# Altium schematic sheet STM32WL_Sensors.SchDoc
size A4; SheetNumber: 4; SheetTotal: 5
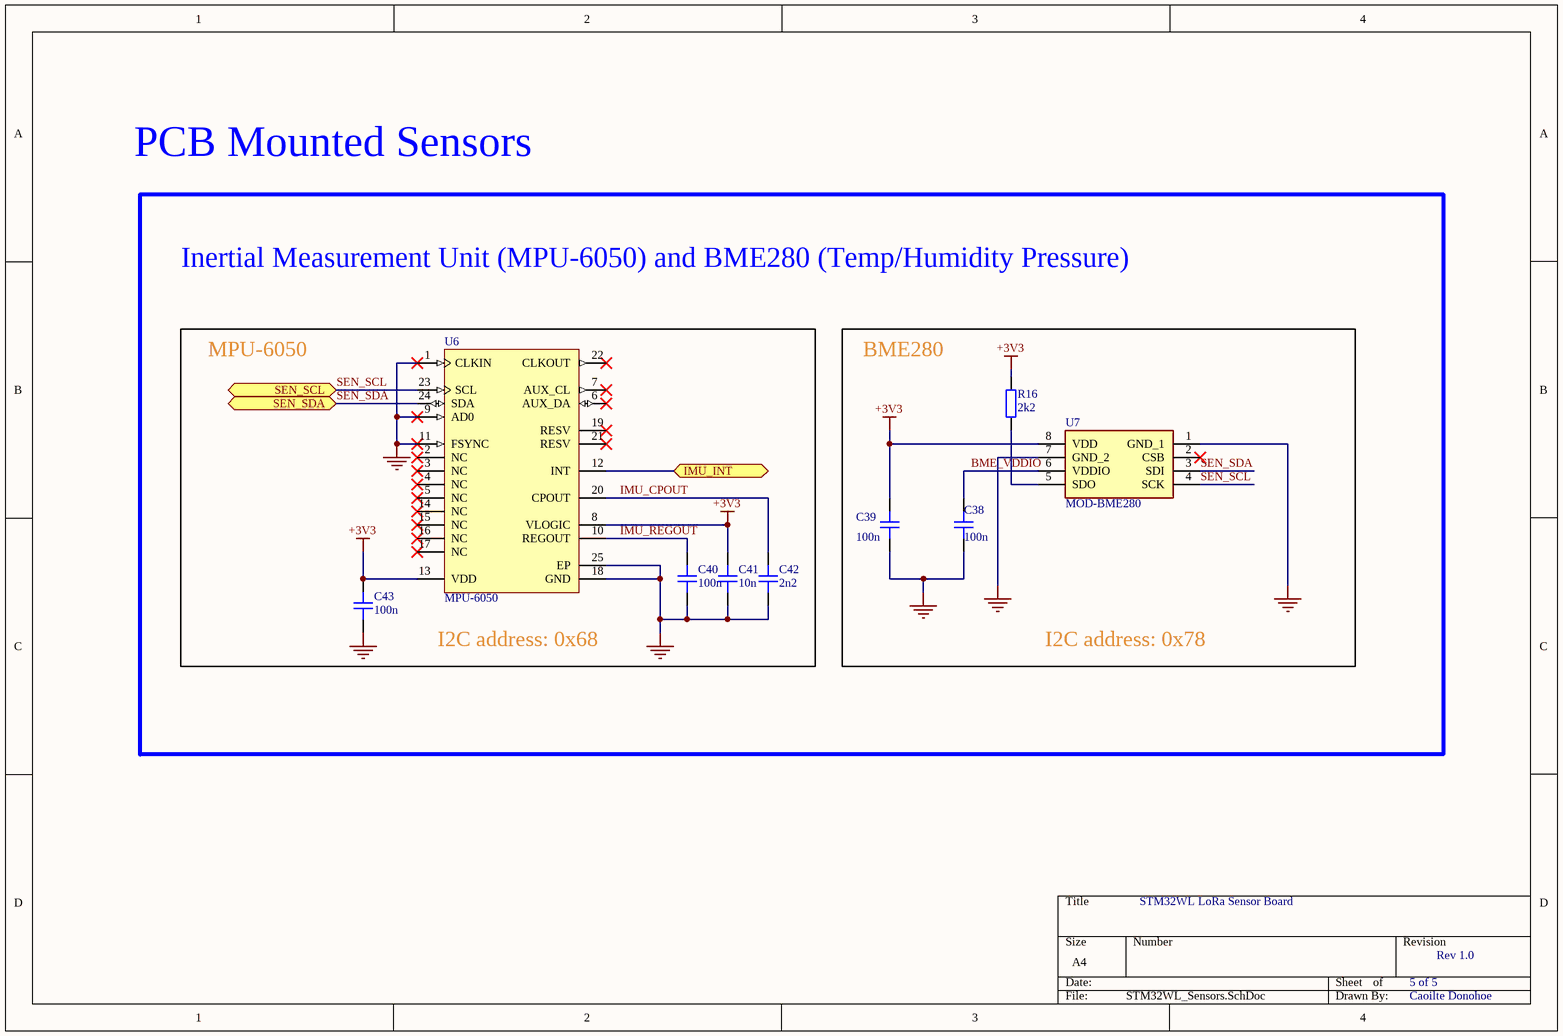
[diagram p0: STM32WL_Sensors.SchDoc]

## Parts
C38  100n  [CAP_0402]
C39  100n  [CAP_0402]
C40  100n  [CAP_0402]
C41  10n  [CAP_0402]
C42  2n2  [CAP_0402]
C43  100n  [CAP_0402]
R16  2k2  [RES_0402]
U6  MPU-6050  [IS-QFN-24_V]
U7  MOD-BME280  [MODBME280]

## Ports
IMU_INT (bidir, see STM32WL_MCU_IOs[1B]), SEN_SCL (bidir, see STM32WL_MCU_IOs[3B]), SEN_SDA (bidir, see STM32WL_MCU_IOs[3B])

## Nets
+3V3: C39.2 C41.2 C43.2 R16.2 U6.8(VLOGIC) U6.13(VDD) U7.8(VDD)
GND: C38.1 C39.1 C40.1 C41.1 C42.1 C43.1 U6.1(CLKIN) U6.9(AD0) U6.11(FSYNC) U6.18(GND) U6.25(EP) U7.1(GND_1) U7.7(GND_2)
BME_VDDIO: C38.2 U7.6(VDDIO)
IMU_CPOUT: C42.2 U6.20(CPOUT)
IMU_INT: U6.12(INT) ; port IMU_INT
IMU_REGOUT: C40.2 U6.10(REGOUT)
SEN_SCL: U6.23(SCL) U7.4(SCK) ; port SEN_SCL
SEN_SDA: U6.24(SDA) U7.3(SDI) ; port SEN_SDA
NetR16_1: R16.1 U7.5(SDO)

Not connected (* = marked no-connect by the designer): U6 2(NC)* 3(NC)* 4(NC)* 5(NC)* 6(AUX_DA)* 7(AUX_CL)* 14(NC)* 15(NC)* 16(NC)* 17(NC)* 19(RESV)* 21(RESV)* 22(CLKOUT)*; U7 2(CSB)*

## Notes on the sheet
- PCB Mounted Sensors
- Inertial Measurement Unit (MPU-6050) and BME280 (Temp/Humidity Pressure)
- MPU-6050
- BME280
- I2C address: 0x68
- I2C address: 0x78
- STM32WL LoRa Sensor Board
- 5 of 5
- Rev 1.0
- Caoilte Donohoe
- Labels drawn without touching a wire or pin: BME_SDO

## Library data of the parts
C38-C43 = CAP_0402_16V: Capacitor SMD 0402 16V
R16 = RES_0402: Resistor SMD 0402
U6 = CMP-1753-00002-2: 3-Axis Gyroscope, Accelerometer and a Digital Motion Processor(TM) (DMP), 2.375 to 3.46 V, -40 to 85 degC, 24-Pin QFN, RoHS, Tape and Reel; Manufacturer: InvenSense; Featured Product: MPU-60506-Axis,IntegratedI²CSolution; Other Names: 1428-1007-2 / MPU6050; Sensor Type: MotionTracking; Online Catalog: MPU-6000™Series; Unit PriceUSD: Digital; Datasheet Version: Rev. 3.3, 05/2012; Category: Sensors,Transducers; Datasheet URL: http://datasheet.octopart.com/MPU-6050-InvenSense-datasheet-14421344.pdf; Family: Multifunction; Standard Package: 5,000; Manufacturer URL: http://www.invensense.com/; Output Type: Digital; Dynamic Catalog: MPU-6000™Series
U7 = MOD-BME280: Integrated Circuit; Manufacturer_Name: Olimex Ltd.; Datasheet Link: https://eu.mouser.com/datasheet/2/306/BME280-1620794.pdf; Height: 1mm; Manufacturer_Part_Number: MOD-BME280; Mouser Part Number: 909-MOD-BME280; Mouser Price/Stock: https://www.mouser.co.uk/ProductDetail/Olimex-Ltd/MOD-BME280?qs=%252B6g0mu59x7K82sEO3yPPgg%3D%3D